# EAGLE design board (EAGLE 6.5.0)
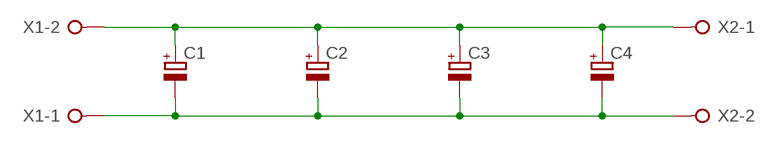
[diagram p0: schematic, sheet 1]

## Parts
C1  CPOL-EUE10-35  [EB35D]
C2  CPOL-EUE10-35  [EB35D]
C3  CPOL-EUE10-35  [EB35D]
C4  CPOL-EUE10-35  [EB35D]
X1  W237-02P  [W237-132]
X2  W237-02P  [W237-132]

## Nets
GND: C1.- C2.- C3.- C4.- X1.1 X2.2
V+: C1.+ C2.+ C3.+ C4.+ X1.2 X2.1

## Library data of the parts
C1-C4 = rcl:CPOL-EU: POLARIZED CAPACITOR, European symbol
X1 X2 = con-wago-508:W237-02P: WAGO SREW CLAMP; OC_FARNELL: unknown; OC_NEWARK: unknown

## Board
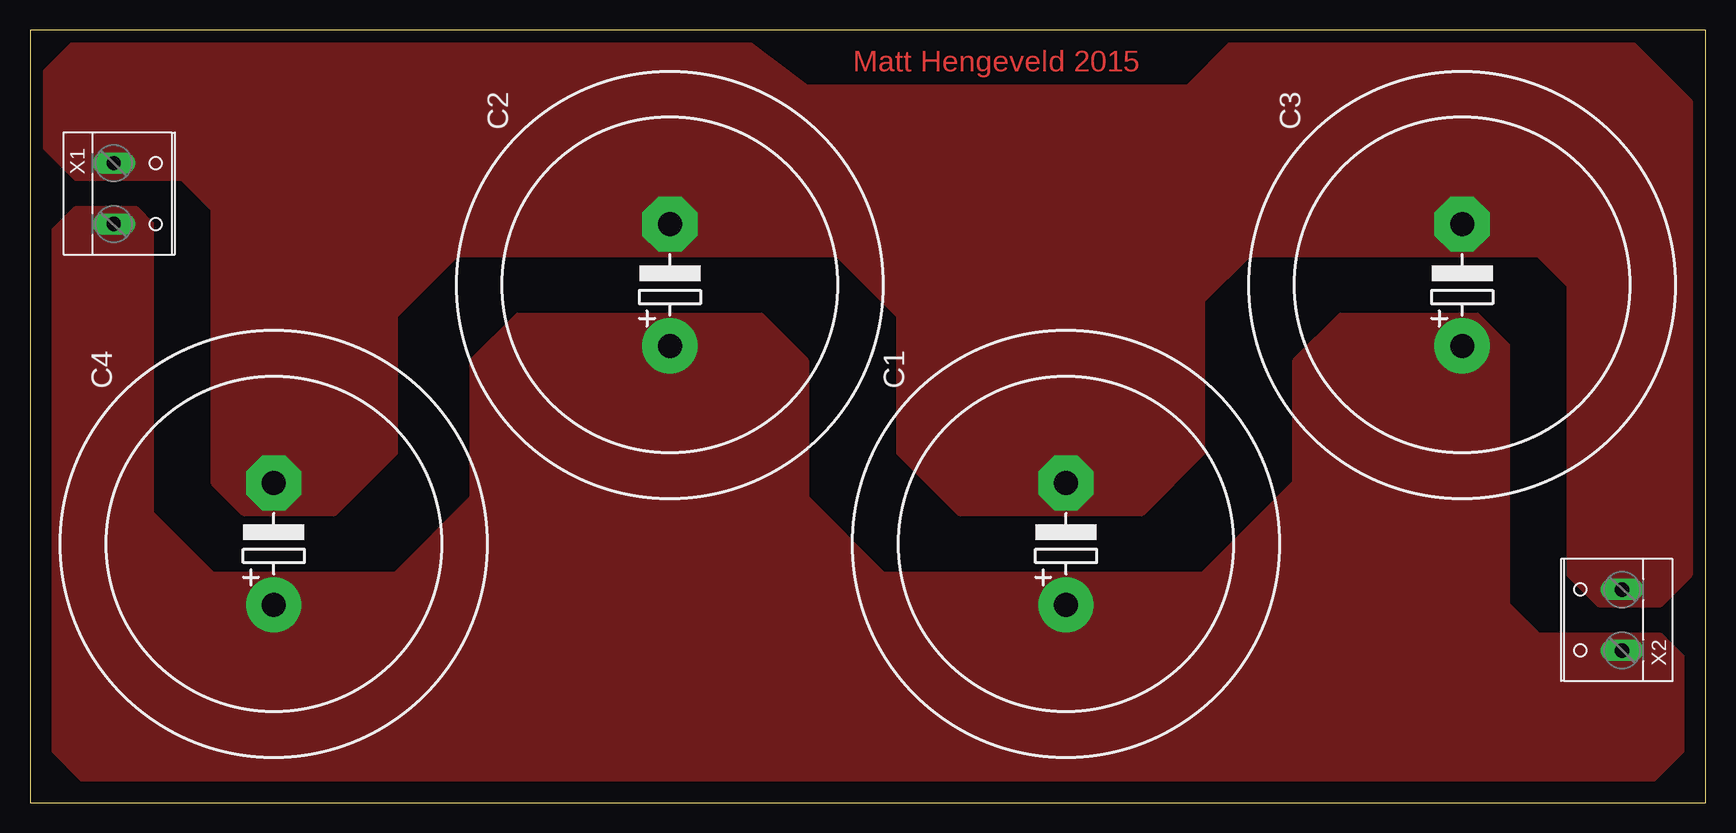
[diagram p1: board, top side]

Size 139.68 x 64.44 mm. Coordinates in mm from the lower left corner, seen from the top.
Outline: 0,0 139.68,0 139.68,64.44 0,64.44 0,0
Copper layers (1*16): Top 0.035mm / dielectric 1.5mm / Bottom 0.035mm
Design rules "default": minimum track width 10mil, minimum drill 24mil, track to track 8mil, track to pad 8mil, pad to pad 8mil, via to via 8mil, smd to smd 8mil, copper to edge 40mil, drill to drill 8mil, minimum pad ring 10mil, minimum via ring 8mil, stop-mask expansion 4mil, vias tented up to drill 0mil, thermal gap 10mil

### Footprints (pad centres in the part's own frame; a part is rotated, then mirrored left to right if it is on the bottom)
EB35D = drill 2.007 pad 4.597: + -5.08,0 | drill 2.007 pad 4.597 octagon: - 5.08,0
W237-132 = drill 1.194 long: 1 -2.54,-0.635; 2 2.54,-0.635

### Placement (x,y rotation side)
C1  86.36,21.59 90 top
C2  53.34,43.18 90 top
C3  119.38,43.18 90 top
C4  20.32,21.59 90 top
X1  7.62,50.8 270 top
X2  132.08,15.24 90 top

### Tracks (layer width: path | path; a pad name or v marks a point on that pad's centre or on a via)
GND
  pour Top (isolate 0.61, no thermals): 3.81,63.5 1.27,60.96 1.27,54.61 3.81,52.07 12.7,52.07 15.24,49.53 15.24,26.67 17.78,24.13 25.4,24.13 30.48,29.21 30.48,40.64 35.56,45.72 67.31,45.72 72.39,40.64 72.39,29.21 77.47,24.13 92.71,24.13 97.79,29.21 97.79,41.91 101.6,45.72 125.73,45.72 128.27,43.18 128.27,19.05 130.81,16.51 135.89,16.51 138.43,19.05 138.43,58.42 133.35,63.5 100.33,63.5 96.52,59.69 64.77,59.69 59.69,63.5
V+
  pour Top (isolate 1.778, no thermals): 3.81,49.53 1.27,46.99 1.27,5.08 5.08,1.27 134.62,1.27 138.43,5.08 138.43,11.43 135.89,13.97 125.73,13.97 123.19,16.51 123.19,38.1 120.65,40.64 109.22,40.64 105.41,36.83 105.41,26.67 97.79,19.05 71.12,19.05 64.77,25.4 64.77,36.83 60.96,40.64 40.64,40.64 36.83,36.83 36.83,25.4 30.48,19.05 15.24,19.05 10.16,24.13 10.16,48.26 8.89,49.53

### Text on the board
Top: Matt Hengeveld 2015